# Altium schematic sheet UART-test-del-other-while-testing.schdoc
size A4
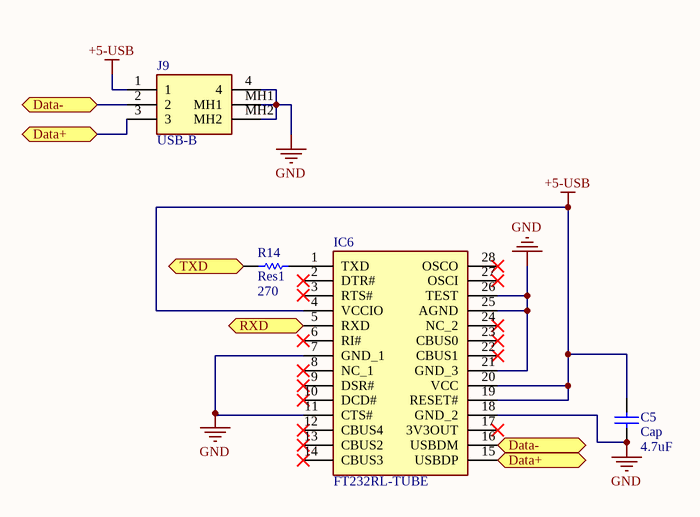
[diagram p0: UART-test-del-other-while-testing.schdoc]

## Parts
C5  Cap  value 4.7uF  [cap 4.7uf]
IC6  FT232RL-TUBE  [SOP65P780X200-28N]
J9  USB-B  [USB B]
R14  Res1  value 270  [Resistor 1206]

## Ports
Data+ (bidir), Data- (bidir), RXD (bidir), TXD (bidir)

## Nets
+5-USB: C5.2 IC6.4(VCCIO) IC6.19(RESET#) IC6.20(VCC) J9.1
GND: C5.1 IC6.7(GND_1) IC6.11(CTS#) IC6.18(GND_2) IC6.21(GND_3) IC6.25(AGND) IC6.26(TEST) J9.4 J9.MH1 J9.MH2
Data+: IC6.15(USBDP) J9.3 ; port Data+
Data-: IC6.16(USBDM) J9.2 ; port Data-
RXD: IC6.5(RXD) ; port RXD
TXD: R14.1 ; port TXD
NetIC6_1: IC6.1(TXD) R14.2

Not connected (* = marked no-connect by the designer): IC6 2(DTR#)* 3(RTS#)* 6(RI#)* 8(NC_1)* 9(DSR#)* 10(DCD#)* 12(CBUS4)* 13(CBUS2)* 14(CBUS3)* 17(3V3OUT)* 22(CBUS1)* 23(CBUS0)* 24(NC_2)* 27(OSCI)* 28(OSCO)*

## Library data of the parts
C5 = Cap: Capacitor; Published: 8-Jun-2000; LatestRevisionDate: 17-Jul-2002; LatestRevisionNote: Re-released for DXP Platform.; PackageReference: RAD-0.3; Publisher: Altium Limited; PackageDescription: Radial Cap, Thru-Hole; 2 Leads; 0.3 in Pin Spacing
IC6 = FT232RL-TUBE: Integrated Circuit; Manufacturer_Name: FTDI Chip; Datasheet Link: http://www.ftdichip.com/Support/Documents/DataSheets/ICs/DS_FT232R.pdf; Height: 2mm; Manufacturer_Part_Number: FT232RL-TUBE; Arrow Part Number: FT232RL-TUBE; Arrow Price/Stock: https://www.arrow.com/en/products/ft232rl-tube/ftdi-chip; Mouser Part Number: 895-FT232RL-TUBE; Mouser Price/Stock: https://www.mouser.co.uk/ProductDetail/FTDI/FT232RL-TUBE?qs=D1%2FPMqvA100UF95YMvGN8w%3D%3D
J9 = USBR-B-S-S-O-TH: Connector; Manufacturer_Name: SAMTEC; Datasheet Link: https://componentsearchengine.com/Datasheets/2/USBR-B-S-S-O-TH.pdf; Height: 11mm; Manufacturer_Part_Number: USBR-B-S-S-O-TH; Arrow Part Number: USBR-B-S-S-O-TH; Arrow Price/Stock: https://www.arrow.com/en/products/usbr-b-s-s-o-th/samtec; Mouser Part Number: 200-USBRBSSOTH; Mouser Price/Stock: https://www.mouser.co.uk/ProductDetail/Samtec/USBR-B-S-S-O-TH?qs=Sk19l0%2FxcWm4mdmoDSlrBQ%3D%3D
R14 = Res1: Resistor; Published: 8-Jun-2000; LatestRevisionDate: 17-Jul-2002; LatestRevisionNote: Re-released for DXP Platform.; PackageReference: AXIAL-0.3; Publisher: Altium Limited; PackageDescription: Axial Device, Thru-Hole; 2 Leads; 0.3 in Pin Spacing